# EAGLE schematic snesram (EAGLE 5.04)
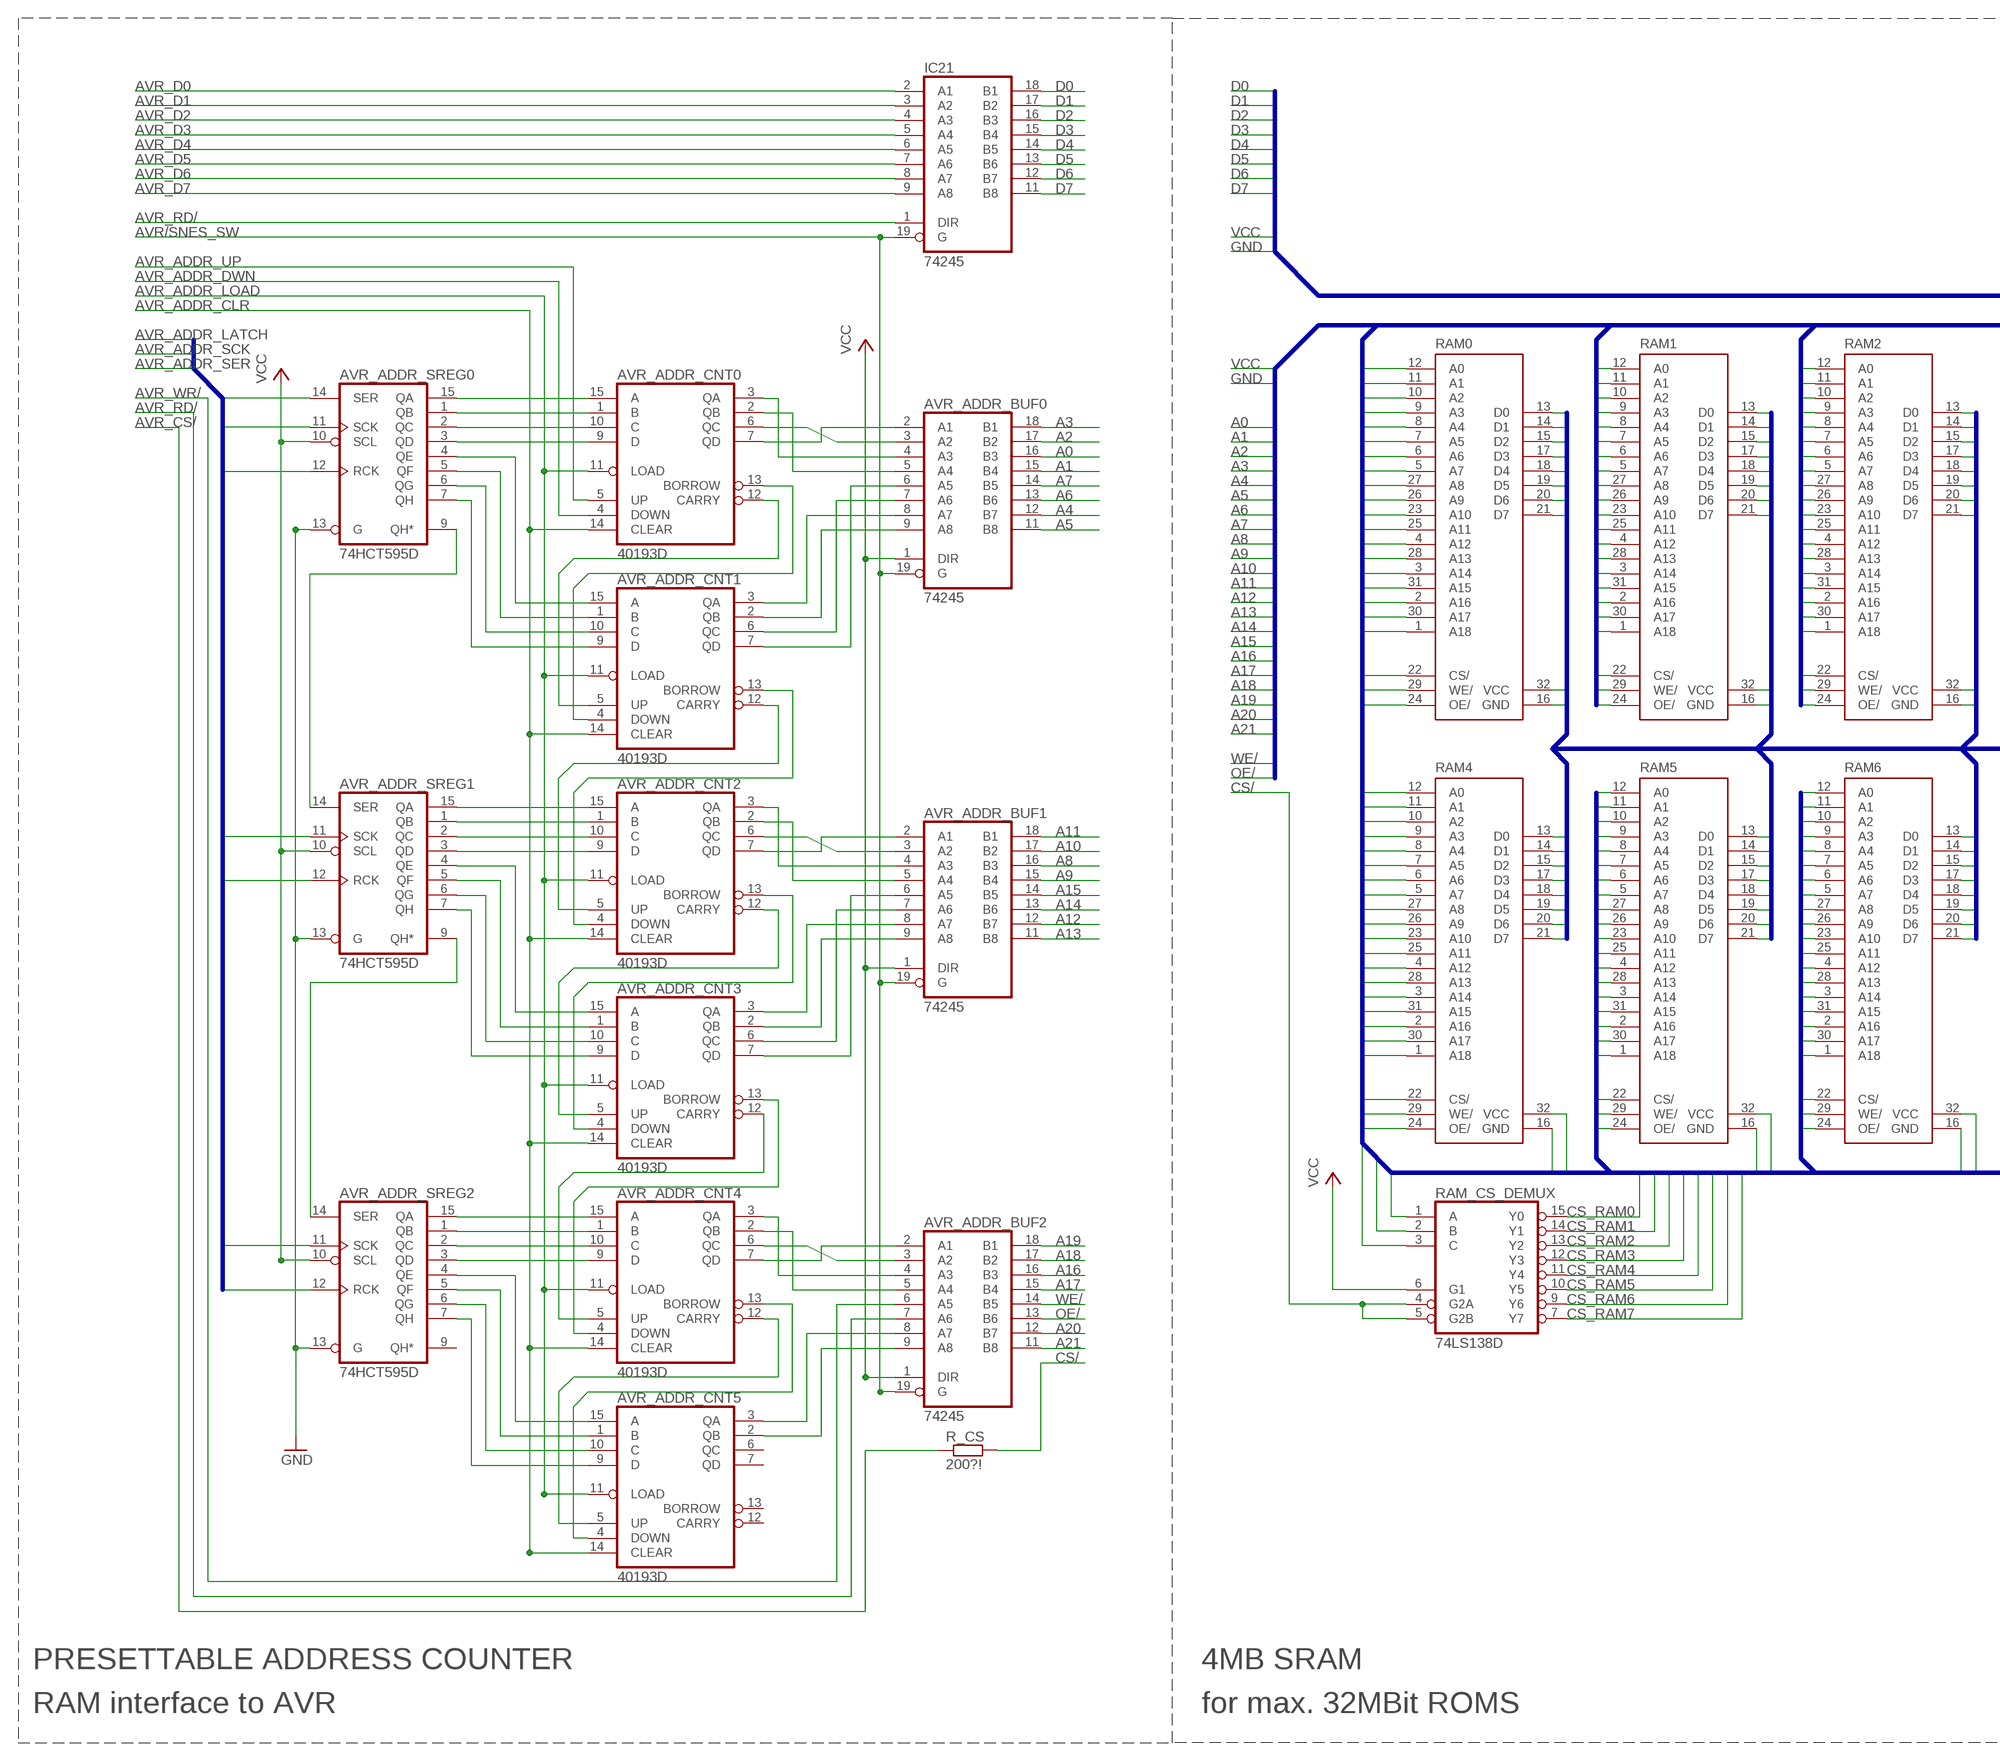
[diagram p0: schematic, sheet 1, part 1 of 2]
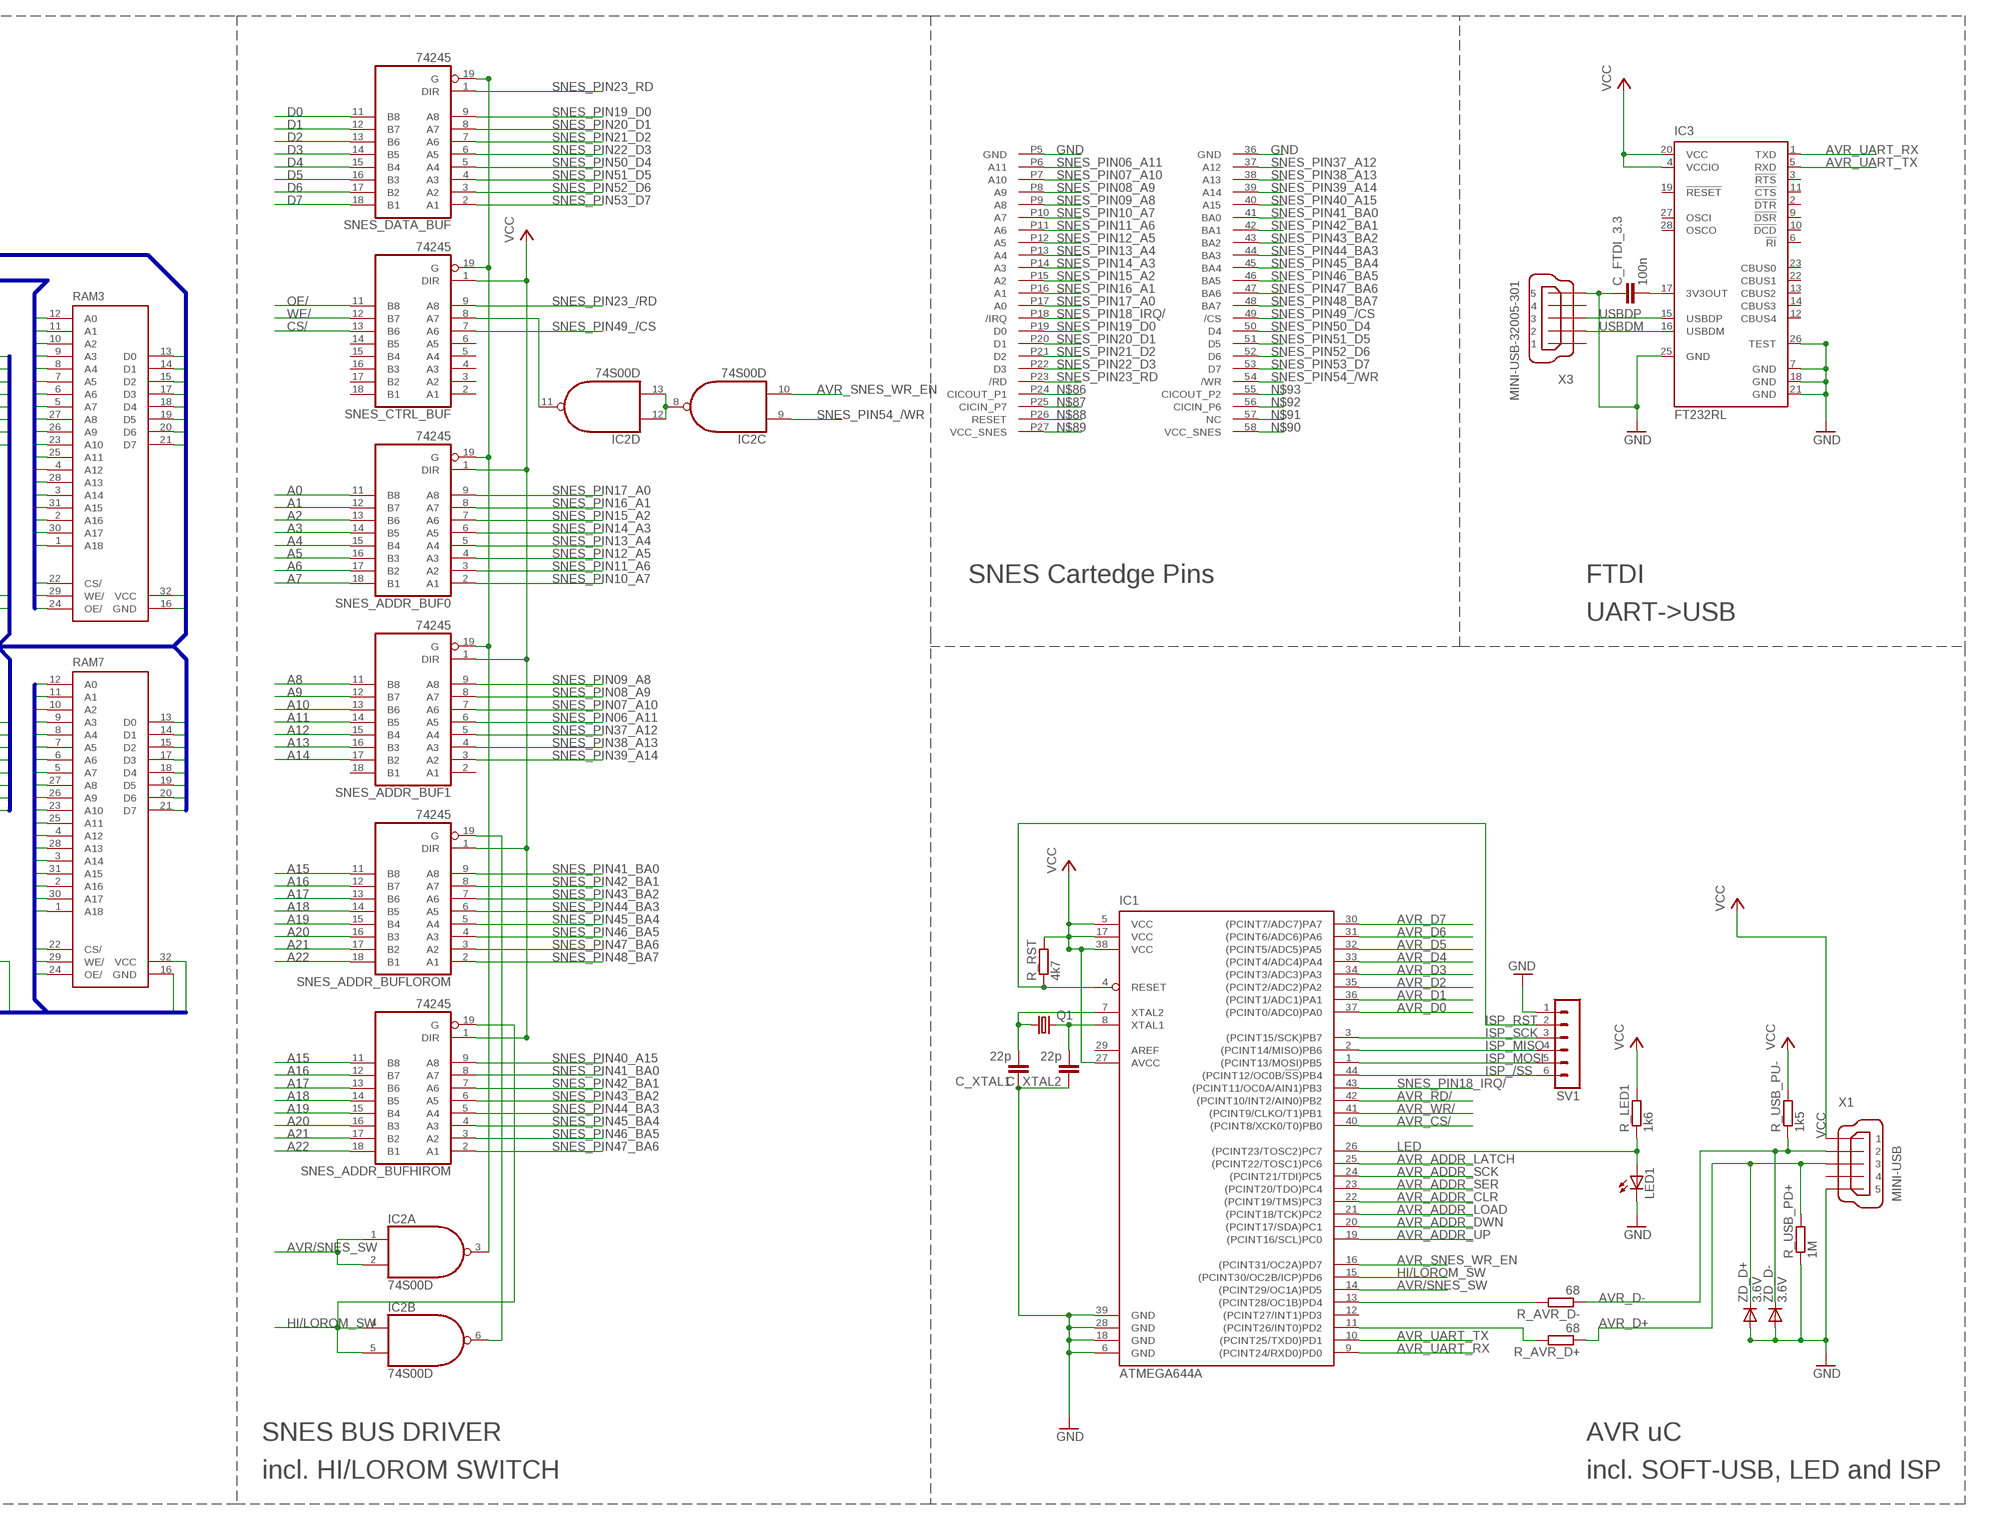
[diagram p1: schematic, sheet 1, part 2 of 2]

## Parts
AVR_ADDR_BUF0  74245  [SO20]
AVR_ADDR_BUF1  74245  [SO20]
AVR_ADDR_BUF2  74245  [SO20]
AVR_ADDR_CNT0  40193D  [SO16]
AVR_ADDR_CNT1  40193D  [SO16]
AVR_ADDR_CNT2  40193D  [SO16]
AVR_ADDR_CNT3  40193D  [SO16]
AVR_ADDR_CNT4  40193D  [SO16]
AVR_ADDR_CNT5  40193D  [SO16]
AVR_ADDR_SREG0  74HCT595D  [SO16]
AVR_ADDR_SREG1  74HCT595D  [SO16]
AVR_ADDR_SREG2  74HCT595D  [SO16]
C_FTDI_3.3  100n  C-EUC0805  [C0805]
C_XTAL1  22p  C-EUC0805  [C0805]
C_XTAL2  22p  C-EUC0805  [C0805]
IC1  ATMEGA644A  [TQFP44]
IC2  74S00D  [SO14]
IC3  FT232RL  [SSOP28]
IC21  74245  [SO20]
LED1  LEDCHIPLED_0805  [CHIPLED_0805]
Q1  CRYSTALHC49UP  [HC49UP]
R_AVR_D+  68  R-EU_R0805  [R0805]
R_AVR_D-  68  R-EU_R0805  [R0805]
R_CS  200?!  R-EU_R0805  [R0805]
R_LED1  1k6  R-EU_R0805  [R0805]
R_RST  4k7  R-EU_R0805  [R0805]
R_USB_PD+  1M  R-EU_R0805  [R0805]
R_USB_PU-  1k5  R-EU_R0805  [R0805]
RAM0  KM628512-XX  [SOP-32]
RAM1  KM628512-XX  [SOP-32]
RAM2  KM628512-XX  [SOP-32]
RAM3  KM628512-XX  [SOP-32]
RAM4  KM628512-XX  [SOP-32]
RAM5  KM628512-XX  [SOP-32]
RAM6  KM628512-XX  [SOP-32]
RAM7  KM628512-XX  [SOP-32]
RAM_CS_DEMUX  74LS138D  [SO16]
SNES_ADDR_BUF0  74245  [SO20]
SNES_ADDR_BUF1  74245  [SO20]
SNES_ADDR_BUFHIROM  74245  [SO20]
SNES_ADDR_BUFLOROM  74245  [SO20]
SNES_CTRL_BUF  74245  [SO20]
SNES_DATA_BUF  74245  [SO20]
SV1  MA06-1  [MA06-1]
U$1  SNES_CON_1  [1X31_SNES_HEADER]
U$2  SNES_CON_2  [1X31_SNES_HEADERBACK]
X1  MINI-USB  MINI-USB-32005-201  [32005-201]
X3  MINI-USB-32005-301  [32005-301]
ZD_D+  3.6V  DIODE-MINIMELF  [MINIMELF]
ZD_D-  3.6V  DIODE-MINIMELF  [MINIMELF]

## Nets
A0: AVR_ADDR_BUF0.16(B3) RAM0.12(A0) RAM1.12(A0) RAM2.12(A0) RAM3.12(A0) RAM4.12(A0) RAM5.12(A0) RAM6.12(A0) RAM7.12(A0) SNES_ADDR_BUF0.11(B8)
A1: AVR_ADDR_BUF0.15(B4) RAM0.11(A1) RAM1.11(A1) RAM2.11(A1) RAM3.11(A1) RAM4.11(A1) RAM5.11(A1) RAM6.11(A1) RAM7.11(A1) SNES_ADDR_BUF0.12(B7)
A2: AVR_ADDR_BUF0.17(B2) RAM0.10(A2) RAM1.10(A2) RAM2.10(A2) RAM3.10(A2) RAM4.10(A2) RAM5.10(A2) RAM6.10(A2) RAM7.10(A2) SNES_ADDR_BUF0.13(B6)
A3: AVR_ADDR_BUF0.18(B1) RAM0.9(A3) RAM1.9(A3) RAM2.9(A3) RAM3.9(A3) RAM4.9(A3) RAM5.9(A3) RAM6.9(A3) RAM7.9(A3) SNES_ADDR_BUF0.14(B5)
A4: AVR_ADDR_BUF0.12(B7) RAM0.8(A4) RAM1.8(A4) RAM2.8(A4) RAM3.8(A4) RAM4.8(A4) RAM5.8(A4) RAM6.8(A4) RAM7.8(A4) SNES_ADDR_BUF0.15(B4)
A5: AVR_ADDR_BUF0.11(B8) RAM0.7(A5) RAM1.7(A5) RAM2.7(A5) RAM3.7(A5) RAM4.7(A5) RAM5.7(A5) RAM6.7(A5) RAM7.7(A5) SNES_ADDR_BUF0.16(B3)
A6: AVR_ADDR_BUF0.13(B6) RAM0.6(A6) RAM1.6(A6) RAM2.6(A6) RAM3.6(A6) RAM4.6(A6) RAM5.6(A6) RAM6.6(A6) RAM7.6(A6) SNES_ADDR_BUF0.17(B2)
A7: AVR_ADDR_BUF0.14(B5) RAM0.5(A7) RAM1.5(A7) RAM2.5(A7) RAM3.5(A7) RAM4.5(A7) RAM5.5(A7) RAM6.5(A7) RAM7.5(A7) SNES_ADDR_BUF0.18(B1)
A8: AVR_ADDR_BUF1.16(B3) RAM0.27(A8) RAM1.27(A8) RAM2.27(A8) RAM3.27(A8) RAM4.27(A8) RAM5.27(A8) RAM6.27(A8) RAM7.27(A8) SNES_ADDR_BUF1.11(B8)
A9: AVR_ADDR_BUF1.15(B4) RAM0.26(A9) RAM1.26(A9) RAM2.26(A9) RAM3.26(A9) RAM4.26(A9) RAM5.26(A9) RAM6.26(A9) RAM7.26(A9) SNES_ADDR_BUF1.12(B7)
A10: AVR_ADDR_BUF1.17(B2) RAM0.23(A10) RAM1.23(A10) RAM2.23(A10) RAM3.23(A10) RAM4.23(A10) RAM5.23(A10) RAM6.23(A10) RAM7.23(A10) SNES_ADDR_BUF1.13(B6)
A11: AVR_ADDR_BUF1.18(B1) RAM0.25(A11) RAM1.25(A11) RAM2.25(A11) RAM3.25(A11) RAM4.25(A11) RAM5.25(A11) RAM6.25(A11) RAM7.25(A11) SNES_ADDR_BUF1.14(B5)
A12: AVR_ADDR_BUF1.12(B7) RAM0.4(A12) RAM1.4(A12) RAM2.4(A12) RAM3.4(A12) RAM4.4(A12) RAM5.4(A12) RAM6.4(A12) RAM7.4(A12) SNES_ADDR_BUF1.15(B4)
A13: AVR_ADDR_BUF1.11(B8) RAM0.28(A13) RAM1.28(A13) RAM2.28(A13) RAM3.28(A13) RAM4.28(A13) RAM5.28(A13) RAM6.28(A13) RAM7.28(A13) SNES_ADDR_BUF1.16(B3)
A14: AVR_ADDR_BUF1.13(B6) RAM0.3(A14) RAM1.3(A14) RAM2.3(A14) RAM3.3(A14) RAM4.3(A14) RAM5.3(A14) RAM6.3(A14) RAM7.3(A14) SNES_ADDR_BUF1.17(B2)
A15: AVR_ADDR_BUF1.14(B5) RAM0.31(A15) RAM1.31(A15) RAM2.31(A15) RAM3.31(A15) RAM4.31(A15) RAM5.31(A15) RAM6.31(A15) RAM7.31(A15) SNES_ADDR_BUFHIROM.11(B8) SNES_ADDR_BUFLOROM.11(B8)
A16: AVR_ADDR_BUF2.16(B3) RAM0.2(A16) RAM1.2(A16) RAM2.2(A16) RAM3.2(A16) RAM4.2(A16) RAM5.2(A16) RAM6.2(A16) RAM7.2(A16) SNES_ADDR_BUFHIROM.12(B7) SNES_ADDR_BUFLOROM.12(B7)
A17: AVR_ADDR_BUF2.15(B4) RAM0.30(A17) RAM1.30(A17) RAM2.30(A17) RAM3.30(A17) RAM4.30(A17) RAM5.30(A17) RAM6.30(A17) RAM7.30(A17) SNES_ADDR_BUFHIROM.13(B6) SNES_ADDR_BUFLOROM.13(B6)
A18: AVR_ADDR_BUF2.17(B2) RAM0.1(A18) RAM1.1(A18) RAM2.1(A18) RAM3.1(A18) RAM4.1(A18) RAM5.1(A18) RAM6.1(A18) RAM7.1(A18) SNES_ADDR_BUFHIROM.14(B5) SNES_ADDR_BUFLOROM.14(B5)
A19: AVR_ADDR_BUF2.18(B1) RAM_CS_DEMUX.1(A) SNES_ADDR_BUFHIROM.15(B4) SNES_ADDR_BUFLOROM.15(B4)
A20: AVR_ADDR_BUF2.12(B7) RAM_CS_DEMUX.2(B) SNES_ADDR_BUFHIROM.16(B3) SNES_ADDR_BUFLOROM.16(B3)
A21: AVR_ADDR_BUF2.11(B8) RAM_CS_DEMUX.3(C) SNES_ADDR_BUFHIROM.17(B2) SNES_ADDR_BUFLOROM.17(B2)
A22: SNES_ADDR_BUFHIROM.18(B1) SNES_ADDR_BUFLOROM.18(B1)
AVR/SNES_SW: AVR_ADDR_BUF0.19(G) AVR_ADDR_BUF1.19(G) AVR_ADDR_BUF2.19(G) IC1.14((PCINT29/OC1A)PD5) IC2.1(A:I0) IC2.2(A:I1) IC21.19(G)
AVR/SNES_SW_INV: IC2.3(A:O) SNES_ADDR_BUF0.19(G) SNES_ADDR_BUF1.19(G) SNES_CTRL_BUF.19(G) SNES_DATA_BUF.19(G)
AVR_ADDR_CLR: AVR_ADDR_CNT0.14(CLEAR) AVR_ADDR_CNT1.14(CLEAR) AVR_ADDR_CNT2.14(CLEAR) AVR_ADDR_CNT3.14(CLEAR) AVR_ADDR_CNT4.14(CLEAR) AVR_ADDR_CNT5.14(CLEAR) IC1.22((PCINT19/TMS)PC3)
AVR_ADDR_DWN: AVR_ADDR_CNT0.4(DOWN) IC1.20((PCINT17/SDA)PC1)
AVR_ADDR_LATCH: IC1.25((PCINT22/TOSC1)PC6)
AVR_ADDR_LOAD: AVR_ADDR_CNT0.11(LOAD) AVR_ADDR_CNT1.11(LOAD) AVR_ADDR_CNT2.11(LOAD) AVR_ADDR_CNT3.11(LOAD) AVR_ADDR_CNT4.11(LOAD) AVR_ADDR_CNT5.11(LOAD) IC1.21((PCINT18/TCK)PC2)
AVR_ADDR_SCK: IC1.24((PCINT21/TDI)PC5)
AVR_ADDR_SER: IC1.23((PCINT20/TDO)PC4)
AVR_ADDR_UP: AVR_ADDR_CNT0.5(UP) IC1.19((PCINT16/SCL)PC0)
AVR_CS/: IC1.40((PCINT8/XCK0/T0)PB0) R_CS.1
AVR_D0: IC1.37((PCINT0/ADC0)PA0) IC21.2(A1)
AVR_D1: IC1.36((PCINT1/ADC1)PA1) IC21.3(A2)
AVR_D2: IC1.35((PCINT2/ADC2)PA2) IC21.4(A3)
AVR_D3: IC1.34((PCINT3/ADC3)PA3) IC21.5(A4)
AVR_D4: IC1.33((PCINT4/ADC4)PA4) IC21.6(A5)
AVR_D5: IC1.32((PCINT5/ADC5)PA5) IC21.7(A6)
AVR_D6: IC1.31((PCINT6/ADC6)PA6) IC21.8(A7)
AVR_D7: IC1.30((PCINT7/ADC7)PA7) IC21.9(A8)
AVR_D+: R_AVR_D+.1 R_USB_PD+.2 X1.3 ZD_D+.C
AVR_D-: R_AVR_D-.1 R_USB_PU-.1 X1.2 ZD_D-.C
AVR_RD/: AVR_ADDR_BUF2.7(A6) IC1.42((PCINT10/INT2/AIN0)PB2) IC21.1(DIR)
AVR_SNES_WR_EN: IC1.16((PCINT31/OC2A)PD7) IC2.10(C:I1)
AVR_UART_RX: IC1.9((PCINT24/RXD0)PD0) IC3.1(TXD)
AVR_UART_TX: IC1.10((PCINT25/TXD0)PD1) IC3.5(RXD)
AVR_WR/: AVR_ADDR_BUF2.6(A5) IC1.41((PCINT9/CLKO/T1)PB1)
CS/: R_CS.2 RAM_CS_DEMUX.4(G2A) RAM_CS_DEMUX.5(G2B) SNES_CTRL_BUF.13(B6)
CS_RAM0: RAM0.22(CS/) RAM_CS_DEMUX.15(Y0)
CS_RAM1: RAM1.22(CS/) RAM_CS_DEMUX.14(Y1)
CS_RAM2: RAM2.22(CS/) RAM_CS_DEMUX.13(Y2)
CS_RAM3: RAM3.22(CS/) RAM_CS_DEMUX.12(Y3)
CS_RAM4: RAM4.22(CS/) RAM_CS_DEMUX.11(Y4)
CS_RAM5: RAM5.22(CS/) RAM_CS_DEMUX.10(Y5)
CS_RAM6: RAM6.22(CS/) RAM_CS_DEMUX.9(Y6)
CS_RAM7: RAM7.22(CS/) RAM_CS_DEMUX.7(Y7)
D0: IC21.18(B1) RAM0.13(D0) RAM1.13(D0) RAM2.13(D0) RAM3.13(D0) RAM4.13(D0) RAM5.13(D0) RAM6.13(D0) RAM7.13(D0) SNES_DATA_BUF.11(B8)
D1: IC21.17(B2) RAM0.14(D1) RAM1.14(D1) RAM2.14(D1) RAM3.14(D1) RAM4.14(D1) RAM5.14(D1) RAM6.14(D1) RAM7.14(D1) SNES_DATA_BUF.12(B7)
D2: IC21.16(B3) RAM0.15(D2) RAM1.15(D2) RAM2.15(D2) RAM3.15(D2) RAM4.15(D2) RAM5.15(D2) RAM6.15(D2) RAM7.15(D2) SNES_DATA_BUF.13(B6)
D3: IC21.15(B4) RAM0.17(D3) RAM1.17(D3) RAM2.17(D3) RAM3.17(D3) RAM4.17(D3) RAM5.17(D3) RAM6.17(D3) RAM7.17(D3) SNES_DATA_BUF.14(B5)
D4: IC21.14(B5) RAM0.18(D4) RAM1.18(D4) RAM2.18(D4) RAM3.18(D4) RAM4.18(D4) RAM5.18(D4) RAM6.18(D4) RAM7.18(D4) SNES_DATA_BUF.15(B4)
D5: IC21.13(B6) RAM0.19(D5) RAM1.19(D5) RAM2.19(D5) RAM3.19(D5) RAM4.19(D5) RAM5.19(D5) RAM6.19(D5) RAM7.19(D5) SNES_DATA_BUF.16(B3)
D6: IC21.12(B7) RAM0.20(D6) RAM1.20(D6) RAM2.20(D6) RAM3.20(D6) RAM4.20(D6) RAM5.20(D6) RAM6.20(D6) RAM7.20(D6) SNES_DATA_BUF.17(B2)
D7: IC21.11(B8) RAM0.21(D7) RAM1.21(D7) RAM2.21(D7) RAM3.21(D7) RAM4.21(D7) RAM5.21(D7) RAM6.21(D7) RAM7.21(D7) SNES_DATA_BUF.18(B1)
GND: AVR_ADDR_SREG0.13(G) AVR_ADDR_SREG1.13(G) AVR_ADDR_SREG2.13(G) C_FTDI_3.3.1 C_XTAL1.1 C_XTAL2.1 IC1.6(GND) IC1.18(GND) IC1.28(GND) IC1.39(GND) IC3.7(GND) IC3.18(GND) IC3.21(GND) IC3.25(GND) IC3.26(TEST) LED1.C R_USB_PD+.1 RAM0.16(GND) RAM1.16(GND) RAM2.16(GND) RAM3.16(GND) RAM4.16(GND) RAM5.16(GND) RAM6.16(GND) RAM7.16(GND) SV1.1 U$1.P5(GND) U$2.36(GND) X1.5 X3.5 ZD_D+.A ZD_D-.A
HI/LOROM_SW: IC1.15((PCINT30/OC2B/ICP)PD6) IC2.4(B:I0) IC2.5(B:I1) SNES_ADDR_BUFHIROM.19(G)
HI/LOROM_SW_INV: IC2.6(B:O) SNES_ADDR_BUFLOROM.19(G)
ISP_/SS: IC1.44((PCINT12/OC0B/!SS!)PB4) SV1.6
ISP_MISO: IC1.2((PCINT14/MISO)PB6) SV1.4
ISP_MOSI: IC1.1((PCINT13/MOSI)PB5) SV1.5
ISP_RST: IC1.4(RESET) R_RST.1 SV1.2
ISP_SCK: IC1.3((PCINT15/SCK)PB7) SV1.3
LATCH: AVR_ADDR_SREG0.12(RCK) AVR_ADDR_SREG1.12(RCK) AVR_ADDR_SREG2.12(RCK)
LED: IC1.26((PCINT23/TOSC2)PC7) LED1.A R_LED1.1
N$1: AVR_ADDR_BUF0.2(A1) AVR_ADDR_CNT0.7(QD)
N$2: AVR_ADDR_BUF1.4(A3) AVR_ADDR_CNT2.3(QA)
N$3: AVR_ADDR_BUF0.5(A4) AVR_ADDR_CNT0.2(QB)
N$4: AVR_ADDR_BUF0.4(A3) AVR_ADDR_CNT0.3(QA)
N$5: AVR_ADDR_BUF0.6(A5) AVR_ADDR_CNT1.7(QD)
N$6: AVR_ADDR_BUF0.7(A6) AVR_ADDR_CNT1.6(QC)
N$7: AVR_ADDR_BUF0.9(A8) AVR_ADDR_CNT1.2(QB)
N$8: AVR_ADDR_BUF0.8(A7) AVR_ADDR_CNT1.3(QA)
N$9: AVR_ADDR_CNT0.12(CARRY) AVR_ADDR_CNT1.5(UP)
N$10: AVR_ADDR_CNT0.13(BORROW) AVR_ADDR_CNT1.4(DOWN)
N$11: AVR_ADDR_SREG0.9(QH*) AVR_ADDR_SREG1.14(SER)
N$12: AVR_ADDR_CNT0.15(A) AVR_ADDR_SREG0.15(QA)
N$13: AVR_ADDR_CNT0.1(B) AVR_ADDR_SREG0.1(QB)
N$14: AVR_ADDR_CNT0.10(C) AVR_ADDR_SREG0.2(QC)
N$15: AVR_ADDR_CNT0.9(D) AVR_ADDR_SREG0.3(QD)
N$16: AVR_ADDR_CNT1.15(A) AVR_ADDR_SREG0.4(QE)
N$17: AVR_ADDR_CNT1.1(B) AVR_ADDR_SREG0.5(QF)
N$18: AVR_ADDR_CNT1.10(C) AVR_ADDR_SREG0.6(QG)
N$19: AVR_ADDR_CNT1.9(D) AVR_ADDR_SREG0.7(QH)
N$20: AVR_ADDR_CNT3.9(D) AVR_ADDR_SREG1.7(QH)
N$21: AVR_ADDR_CNT2.1(B) AVR_ADDR_SREG1.1(QB)
N$22: AVR_ADDR_CNT2.10(C) AVR_ADDR_SREG1.2(QC)
N$23: AVR_ADDR_CNT2.9(D) AVR_ADDR_SREG1.3(QD)
N$24: AVR_ADDR_CNT1.12(CARRY) AVR_ADDR_CNT2.5(UP)
N$25: AVR_ADDR_CNT1.13(BORROW) AVR_ADDR_CNT2.4(DOWN)
N$26: AVR_ADDR_BUF1.5(A4) AVR_ADDR_CNT2.2(QB)
N$27: AVR_ADDR_BUF1.3(A2) AVR_ADDR_CNT2.6(QC)
N$28: AVR_ADDR_BUF1.2(A1) AVR_ADDR_CNT2.7(QD)
N$29: AVR_ADDR_BUF2.4(A3) AVR_ADDR_CNT4.3(QA)
N$30: AVR_ADDR_CNT3.15(A) AVR_ADDR_SREG1.4(QE)
N$31: AVR_ADDR_CNT3.1(B) AVR_ADDR_SREG1.5(QF)
N$32: AVR_ADDR_CNT3.10(C) AVR_ADDR_SREG1.6(QG)
N$33: AVR_ADDR_BUF1.8(A7) AVR_ADDR_CNT3.3(QA)
N$34: AVR_ADDR_BUF1.9(A8) AVR_ADDR_CNT3.2(QB)
N$35: AVR_ADDR_BUF1.7(A6) AVR_ADDR_CNT3.6(QC)
N$36: AVR_ADDR_BUF1.6(A5) AVR_ADDR_CNT3.7(QD)
N$37: AVR_ADDR_CNT2.15(A) AVR_ADDR_SREG1.15(QA)
N$38: AVR_ADDR_SREG1.9(QH*) AVR_ADDR_SREG2.14(SER)
N$39: AVR_ADDR_CNT2.12(CARRY) AVR_ADDR_CNT3.5(UP)
N$40: AVR_ADDR_CNT2.13(BORROW) AVR_ADDR_CNT3.4(DOWN)
N$41: AVR_ADDR_CNT3.12(CARRY) AVR_ADDR_CNT4.5(UP)
N$42: AVR_ADDR_CNT3.13(BORROW) AVR_ADDR_CNT4.4(DOWN)
N$43: AVR_ADDR_BUF2.5(A4) AVR_ADDR_CNT4.2(QB)
N$44: AVR_ADDR_BUF2.3(A2) AVR_ADDR_CNT4.6(QC)
N$45: AVR_ADDR_BUF2.2(A1) AVR_ADDR_CNT4.7(QD)
N$47: AVR_ADDR_CNT4.12(CARRY) AVR_ADDR_CNT5.5(UP)
N$48: AVR_ADDR_CNT4.13(BORROW) AVR_ADDR_CNT5.4(DOWN)
N$49: AVR_ADDR_BUF2.8(A7) AVR_ADDR_CNT5.3(QA)
N$50: AVR_ADDR_BUF2.9(A8) AVR_ADDR_CNT5.2(QB)
N$51: C_FTDI_3.3.2 IC3.17(3V3OUT)
N$52: IC2.11(D:O) SNES_CTRL_BUF.8(A7)
N$53: AVR_ADDR_CNT4.15(A) AVR_ADDR_SREG2.15(QA)
N$54: AVR_ADDR_CNT4.1(B) AVR_ADDR_SREG2.1(QB)
N$55: AVR_ADDR_CNT4.10(C) AVR_ADDR_SREG2.2(QC)
N$56: AVR_ADDR_CNT4.9(D) AVR_ADDR_SREG2.3(QD)
N$57: AVR_ADDR_CNT5.15(A) AVR_ADDR_SREG2.4(QE)
N$58: AVR_ADDR_CNT5.1(B) AVR_ADDR_SREG2.5(QF)
N$59: AVR_ADDR_CNT5.10(C) AVR_ADDR_SREG2.6(QG)
N$60: AVR_ADDR_CNT5.9(D) AVR_ADDR_SREG2.7(QH)
N$61: IC1.13((PCINT28/OC1B)PD4) R_AVR_D-.2
N$62: IC1.11((PCINT26/INT0)PD2) R_AVR_D+.2
N$63: C_XTAL2.2 IC1.8(XTAL1) Q1.2
N$64: AVR_ADDR_BUF0.3(A2) AVR_ADDR_CNT0.6(QC)
N$65: IC2.8(C:O) IC2.12(D:I0) IC2.13(D:I1)
N$68: C_XTAL1.2 IC1.7(XTAL2) Q1.1
N$86: U$1.P24(CICOUT_P1)
N$87: U$1.P25(CICIN_P7)
N$88: U$1.P26(RESET)
N$89: U$1.P27(VCC_SNES)
N$90: U$2.58(VCC_SNES)
N$91: U$2.57(NC)
N$92: U$2.56(CICIN_P6)
N$93: U$2.55(CICOUT_P2)
OE/: AVR_ADDR_BUF2.13(B6) RAM0.24(OE/) RAM1.24(OE/) RAM2.24(OE/) RAM3.24(OE/) RAM4.24(OE/) RAM5.24(OE/) RAM6.24(OE/) RAM7.24(OE/) SNES_CTRL_BUF.11(B8)
SCK: AVR_ADDR_SREG0.11(SCK) AVR_ADDR_SREG1.11(SCK) AVR_ADDR_SREG2.11(SCK)
SER: AVR_ADDR_SREG0.14(SER)
SNES_PIN06_A11: SNES_ADDR_BUF1.6(A5) U$1.P6(A11)
SNES_PIN07_A10: SNES_ADDR_BUF1.7(A6) U$1.P7(A10)
SNES_PIN08_A9: SNES_ADDR_BUF1.8(A7) U$1.P8(A9)
SNES_PIN09_A8: SNES_ADDR_BUF1.9(A8) U$1.P9(A8)
SNES_PIN10_A7: SNES_ADDR_BUF0.2(A1) U$1.P10(A7)
SNES_PIN11_A6: SNES_ADDR_BUF0.3(A2) U$1.P11(A6)
SNES_PIN12_A5: SNES_ADDR_BUF0.4(A3) U$1.P12(A5)
SNES_PIN13_A4: SNES_ADDR_BUF0.5(A4) U$1.P13(A4)
SNES_PIN14_A3: SNES_ADDR_BUF0.6(A5) U$1.P14(A3)
SNES_PIN15_A2: SNES_ADDR_BUF0.7(A6) U$1.P15(A2)
SNES_PIN16_A1: SNES_ADDR_BUF0.8(A7) U$1.P16(A1)
SNES_PIN17_A0: SNES_ADDR_BUF0.9(A8) U$1.P17(A0)
SNES_PIN18_IRQ/: IC1.43((PCINT11/OC0A/AIN1)PB3) U$1.P18(/IRQ)
SNES_PIN19_D0: SNES_DATA_BUF.9(A8) U$1.P19(D0)
SNES_PIN20_D1: SNES_DATA_BUF.8(A7) U$1.P20(D1)
SNES_PIN21_D2: SNES_DATA_BUF.7(A6) U$1.P21(D2)
SNES_PIN22_D3: SNES_DATA_BUF.6(A5) U$1.P22(D3)
SNES_PIN23_/RD: SNES_CTRL_BUF.9(A8)
SNES_PIN23_RD: SNES_DATA_BUF.1(DIR) U$1.P23(/RD)
SNES_PIN37_A12: SNES_ADDR_BUF1.5(A4) U$2.37(A12)
SNES_PIN38_A13: SNES_ADDR_BUF1.4(A3) U$2.38(A13)
SNES_PIN39_A14: SNES_ADDR_BUF1.3(A2) U$2.39(A14)
SNES_PIN40_A15: SNES_ADDR_BUFHIROM.9(A8) U$2.40(A15)
SNES_PIN41_BA0: SNES_ADDR_BUFHIROM.8(A7) SNES_ADDR_BUFLOROM.9(A8) U$2.41(BA0)
SNES_PIN42_BA1: SNES_ADDR_BUFHIROM.7(A6) SNES_ADDR_BUFLOROM.8(A7) U$2.42(BA1)
SNES_PIN43_BA2: SNES_ADDR_BUFHIROM.6(A5) SNES_ADDR_BUFLOROM.7(A6) U$2.43(BA2)
SNES_PIN44_BA3: SNES_ADDR_BUFHIROM.5(A4) SNES_ADDR_BUFLOROM.6(A5) U$2.44(BA3)
SNES_PIN45_BA4: SNES_ADDR_BUFHIROM.4(A3) SNES_ADDR_BUFLOROM.5(A4) U$2.45(BA4)
SNES_PIN46_BA5: SNES_ADDR_BUFHIROM.3(A2) SNES_ADDR_BUFLOROM.4(A3) U$2.46(BA5)
SNES_PIN47_BA6: SNES_ADDR_BUFHIROM.2(A1) SNES_ADDR_BUFLOROM.3(A2) U$2.47(BA6)
SNES_PIN48_BA7: SNES_ADDR_BUFLOROM.2(A1) U$2.48(BA7)
SNES_PIN49_/CS: SNES_CTRL_BUF.7(A6) U$2.49(/CS)
SNES_PIN50_D4: SNES_DATA_BUF.5(A4) U$2.50(D4)
SNES_PIN51_D5: SNES_DATA_BUF.4(A3) U$2.51(D5)
SNES_PIN52_D6: SNES_DATA_BUF.3(A2) U$2.52(D6)
SNES_PIN53_D7: SNES_DATA_BUF.2(A1) U$2.53(D7)
SNES_PIN54_/WR: IC2.9(C:I0) U$2.54(/WR)
USBDM: IC3.16(USBDM) X3.2
USBDP: IC3.15(USBDP) X3.3
VCC: AVR_ADDR_BUF0.1(DIR) AVR_ADDR_BUF1.1(DIR) AVR_ADDR_BUF2.1(DIR) AVR_ADDR_SREG0.10(SCL) AVR_ADDR_SREG1.10(SCL) AVR_ADDR_SREG2.10(SCL) IC1.5(VCC) IC1.17(VCC) IC1.27(AVCC) IC1.38(VCC) IC3.4(VCCIO) IC3.20(VCC) R_LED1.2 R_RST.2 R_USB_PU-.2 RAM0.32(VCC) RAM1.32(VCC) RAM2.32(VCC) RAM3.32(VCC) RAM4.32(VCC) RAM5.32(VCC) RAM6.32(VCC) RAM7.32(VCC) RAM_CS_DEMUX.6(G1) SNES_ADDR_BUF0.1(DIR) SNES_ADDR_BUF1.1(DIR) SNES_ADDR_BUFHIROM.1(DIR) SNES_ADDR_BUFLOROM.1(DIR) SNES_CTRL_BUF.1(DIR) X1.1
WE/: AVR_ADDR_BUF2.14(B5) RAM0.29(WE/) RAM1.29(WE/) RAM2.29(WE/) RAM3.29(WE/) RAM4.29(WE/) RAM5.29(WE/) RAM6.29(WE/) RAM7.29(WE/) SNES_CTRL_BUF.12(B7)
Unconnected: AVR_ADDR_CNT5.6(QC) AVR_ADDR_CNT5.7(QD) AVR_ADDR_CNT5.12(CARRY) AVR_ADDR_CNT5.13(BORROW) AVR_ADDR_SREG2.9(QH*) IC1.12((PCINT27/INT1)PD3) IC1.29(AREF) IC3.2(!DTR) IC3.3(!RTS) IC3.6(!RI) IC3.9(!DSR) IC3.10(!DCD) IC3.11(!CTS) IC3.12(CBUS4) IC3.13(CBUS2) IC3.14(CBUS3) IC3.19(!RESET) IC3.22(CBUS1) IC3.23(CBUS0) IC3.27(OSCI) IC3.28(OSCO) SNES_ADDR_BUF1.2(A1) SNES_ADDR_BUF1.18(B1) SNES_CTRL_BUF.2(A1) SNES_CTRL_BUF.3(A2) SNES_CTRL_BUF.4(A3) SNES_CTRL_BUF.5(A4) SNES_CTRL_BUF.6(A5) SNES_CTRL_BUF.14(B5) SNES_CTRL_BUF.15(B4) SNES_CTRL_BUF.16(B3) SNES_CTRL_BUF.17(B2) SNES_CTRL_BUF.18(B1) X1.4 X3.1 X3.4

## Buses
ADDR:VCC,GND,A0,A1,A2,A3,A4,A5,A6,A7,A8,A9,A10,A11,A12,A13,A14,A15,A16,A17,A18,A19,A20,A21,CS_RAM0,CS_RAM1,CS_RAM2,CS_RAM3,CS_RAM4,CS_RAM5,CS_RAM6,CS_RAM7,WE/,OE/
DATA:VCC,GND,D0,D1,D2,D3,D4,D5,D6,D7
SPI:SER,SCK,LATCH

## Notes on the sheet
- SNES Cartedge Pins | FTDI
- UART->USB
- PRESETTABLE ADDRESS COUNTER | 4MB SRAM | SNES BUS DRIVER | AVR uC
- RAM interface to AVR | for max. 32MBit ROMS | incl. HI/LOROM SWITCH | incl. SOFT-USB, LED and ISP

## Power pins joined to a net without a drawn wire
GND: AVR_ADDR_BUF0.10(GND) AVR_ADDR_BUF1.10(GND) AVR_ADDR_BUF2.10(GND) AVR_ADDR_SREG0.8(GND) AVR_ADDR_SREG1.8(GND) AVR_ADDR_SREG2.8(GND) IC2.7(P:GND) IC21.10(GND) RAM_CS_DEMUX.8(GND) SNES_ADDR_BUF0.10(GND) SNES_ADDR_BUF1.10(GND) SNES_ADDR_BUFHIROM.10(GND) SNES_ADDR_BUFLOROM.10(GND) SNES_CTRL_BUF.10(GND) SNES_DATA_BUF.10(GND)
VCC: AVR_ADDR_BUF0.20(VCC) AVR_ADDR_BUF1.20(VCC) AVR_ADDR_BUF2.20(VCC) AVR_ADDR_SREG0.16(VCC) AVR_ADDR_SREG1.16(VCC) AVR_ADDR_SREG2.16(VCC) IC2.14(P:VCC) IC21.20(VCC) RAM_CS_DEMUX.16(VCC) SNES_ADDR_BUF0.20(VCC) SNES_ADDR_BUF1.20(VCC) SNES_ADDR_BUFHIROM.20(VCC) SNES_ADDR_BUFLOROM.20(VCC) SNES_CTRL_BUF.20(VCC) SNES_DATA_BUF.20(VCC)
VDD: AVR_ADDR_CNT0.16(VDD) AVR_ADDR_CNT1.16(VDD) AVR_ADDR_CNT2.16(VDD) AVR_ADDR_CNT3.16(VDD) AVR_ADDR_CNT4.16(VDD) AVR_ADDR_CNT5.16(VDD)
VSS: AVR_ADDR_CNT0.8(VSS) AVR_ADDR_CNT1.8(VSS) AVR_ADDR_CNT2.8(VSS) AVR_ADDR_CNT3.8(VSS) AVR_ADDR_CNT4.8(VSS) AVR_ADDR_CNT5.8(VSS)

## Library data of the parts
AVR_ADDR_BUF0 AVR_ADDR_BUF1 AVR_ADDR_BUF2 IC21 SNES_ADDR_BUF0 SNES_ADDR_BUF1 SNES_ADDR_BUFHIROM SNES_ADDR_BUFLOROM SNES_CTRL_BUF SNES_DATA_BUF = 74xx-eu:74*245: Octal BUS TRANSCEIVER, 3-state
AVR_ADDR_CNT0 AVR_ADDR_CNT1-AVR_ADDR_CNT5 = 40xx:40193: Binary up down COUNTER
AVR_ADDR_SREG0 AVR_ADDR_SREG1 AVR_ADDR_SREG2 = 74xx-eu:74*595: 8-bit SHIFT REGISTER, output latch
C_FTDI_3.3 C_XTAL1 C_XTAL2 = rcl:C-EU: CAPACITOR, European symbol
IC1 = atmel:ATMEGA644: 8-bit Microcontroller with 64K Bytes In-System Programmable Flash Source: http://www.atmel.com/dyn/resources/prod_documents/doc2593.pdf
IC2 = 74xx-us:74*00: Quad 2-input NAND gate
IC3 = ftdichip:FT232R: Source: http://www.ftdichip.com/Documents/DataSheets/DS_FT232R_v104.pdf
LED1 = led:LED: LED OSRAM: - CHIPLED LG R971, LG N971, LY N971, LG Q971, LY Q971, LO R971, LY R971 LH N974, LH R974 LS Q976, LO Q976, LY Q976 LO Q996 - Hyper CHIPLED LW Q18S LB Q993, LB Q99A, LB R99A - SideLED LS A670, LO A670, LY A670, LG A670, LP A670 LB A673, LV A673, LT A673, LW A673 LH A674 LY A675 LS A676, LA A676, LO A676, LY A676, LW A676 LS A679, LY A679, LG A679 - Hyper Micro SIDELED® LS Y876, LA Y876, LO Y876, LY Y876 LT Y87S - SmartLED LW L88C, LW L88S LB L89C, LB L89S, LG L890 LS L89K, LO L89K, LY L89K LS L896, LA L896, LO L896, LY L896 - TOPLED LS T670, LO T670, LY T670, LG T670, LP T670 LSG T670, LSP T670, LSY T670, LOP T670, LYG T670 LG T671, LOG T671, LSG T671 LB T673, LV T673, LT T673, LW T673 LH T674 LS T676, LA T676, LO T676, LY T676, LB T676, LH T676, LSB T676, LW T676 LB T67C, LV T67C, LT T67C, LS T67K, LO T67K, LY T67K, LW E67C LS E67B, LA E67B, LO E67B, LY E67B, LB E67C, LV E67C, LT E67C LW T67C LS T679, LY T679, LG T679 LS T770, LO T770, LY T770, LG T770, LP T770 LB T773, LV T773, LT T773, LW T773 LH T774 LS E675, LA E675, LY E675, LS T675 LS T776, LA T776, LO T776, LY T776, LB T776 LHGB T686 LT T68C, LB T68C - Hyper Mini TOPLED® LB M676 - Mini TOPLED Santana® LG M470 LS M47K, LO M47K, LY M47K Source: http://www.osram.convergy.de LUXEON: - LUMILED® LXK2-PW12-R00, LXK2-PW12-S00, LXK2-PW14-U00, LXK2-PW14-V00 LXK2-PM12-R00, LXK2-PM12-S00, LXK2-PM14-U00 LXK2-PE12-Q00, LXK2-PE12-R00, LXK2-PE12-S00, LXK2-PE14-T00, LXK2-PE14-U00 LXK2-PB12-K00, LXK2-PB12-L00, LXK2-PB12-M00, LXK2-PB14-N00, LXK2-PB14-P00, LXK2-PB14-Q00 LXK2-PR12-L00, LXK2-PR12-M00, LXK2-PR14-Q00, LXK2-PR14-R00 LXK2-PD12-Q00, LXK2-PD12-R00, LXK2-PD12-S00 LXK2-PH12-R00, LXK2-PH12-S00 LXK2-PL12-P00, LXK2-PL12-Q00, LXK2-PL12-R00 Source: www.luxeon.com KINGBRIGHT: KA-3528ASYC Source: www.kingbright.com
Q1 = crystal:CRYSTAL: CRYSTAL
R_AVR_D+ R_AVR_D- R_LED1 R_RST R_USB_PD+ R_USB_PU- = rcl:R-EU_: RESISTOR, European symbol
R_CS = resistor:R-EU_: RESISTOR, European symbol
RAM0 RAM1-RAM7 = memory-samsung-2:KM628512-XX
RAM_CS_DEMUX = 74xx-eu:74*138: 3-line to 8-line DECODER/DEMULTIPLEXER
SV1 = con-lstb:MA06-1: PIN HEADER
U$1 = snes_con:SNES_CON_1
U$2 = snes_con:SNES_CON_2
X1 X3 = con-cypressindustries:MINI-USB-: MINI USB-B Conector Source: www.cypressindustries.com
ZD_D+ ZD_D- = diode:DIODE-: DIODE